# EAGLE design Torsteuerung_1.0 (EAGLE 6.4)
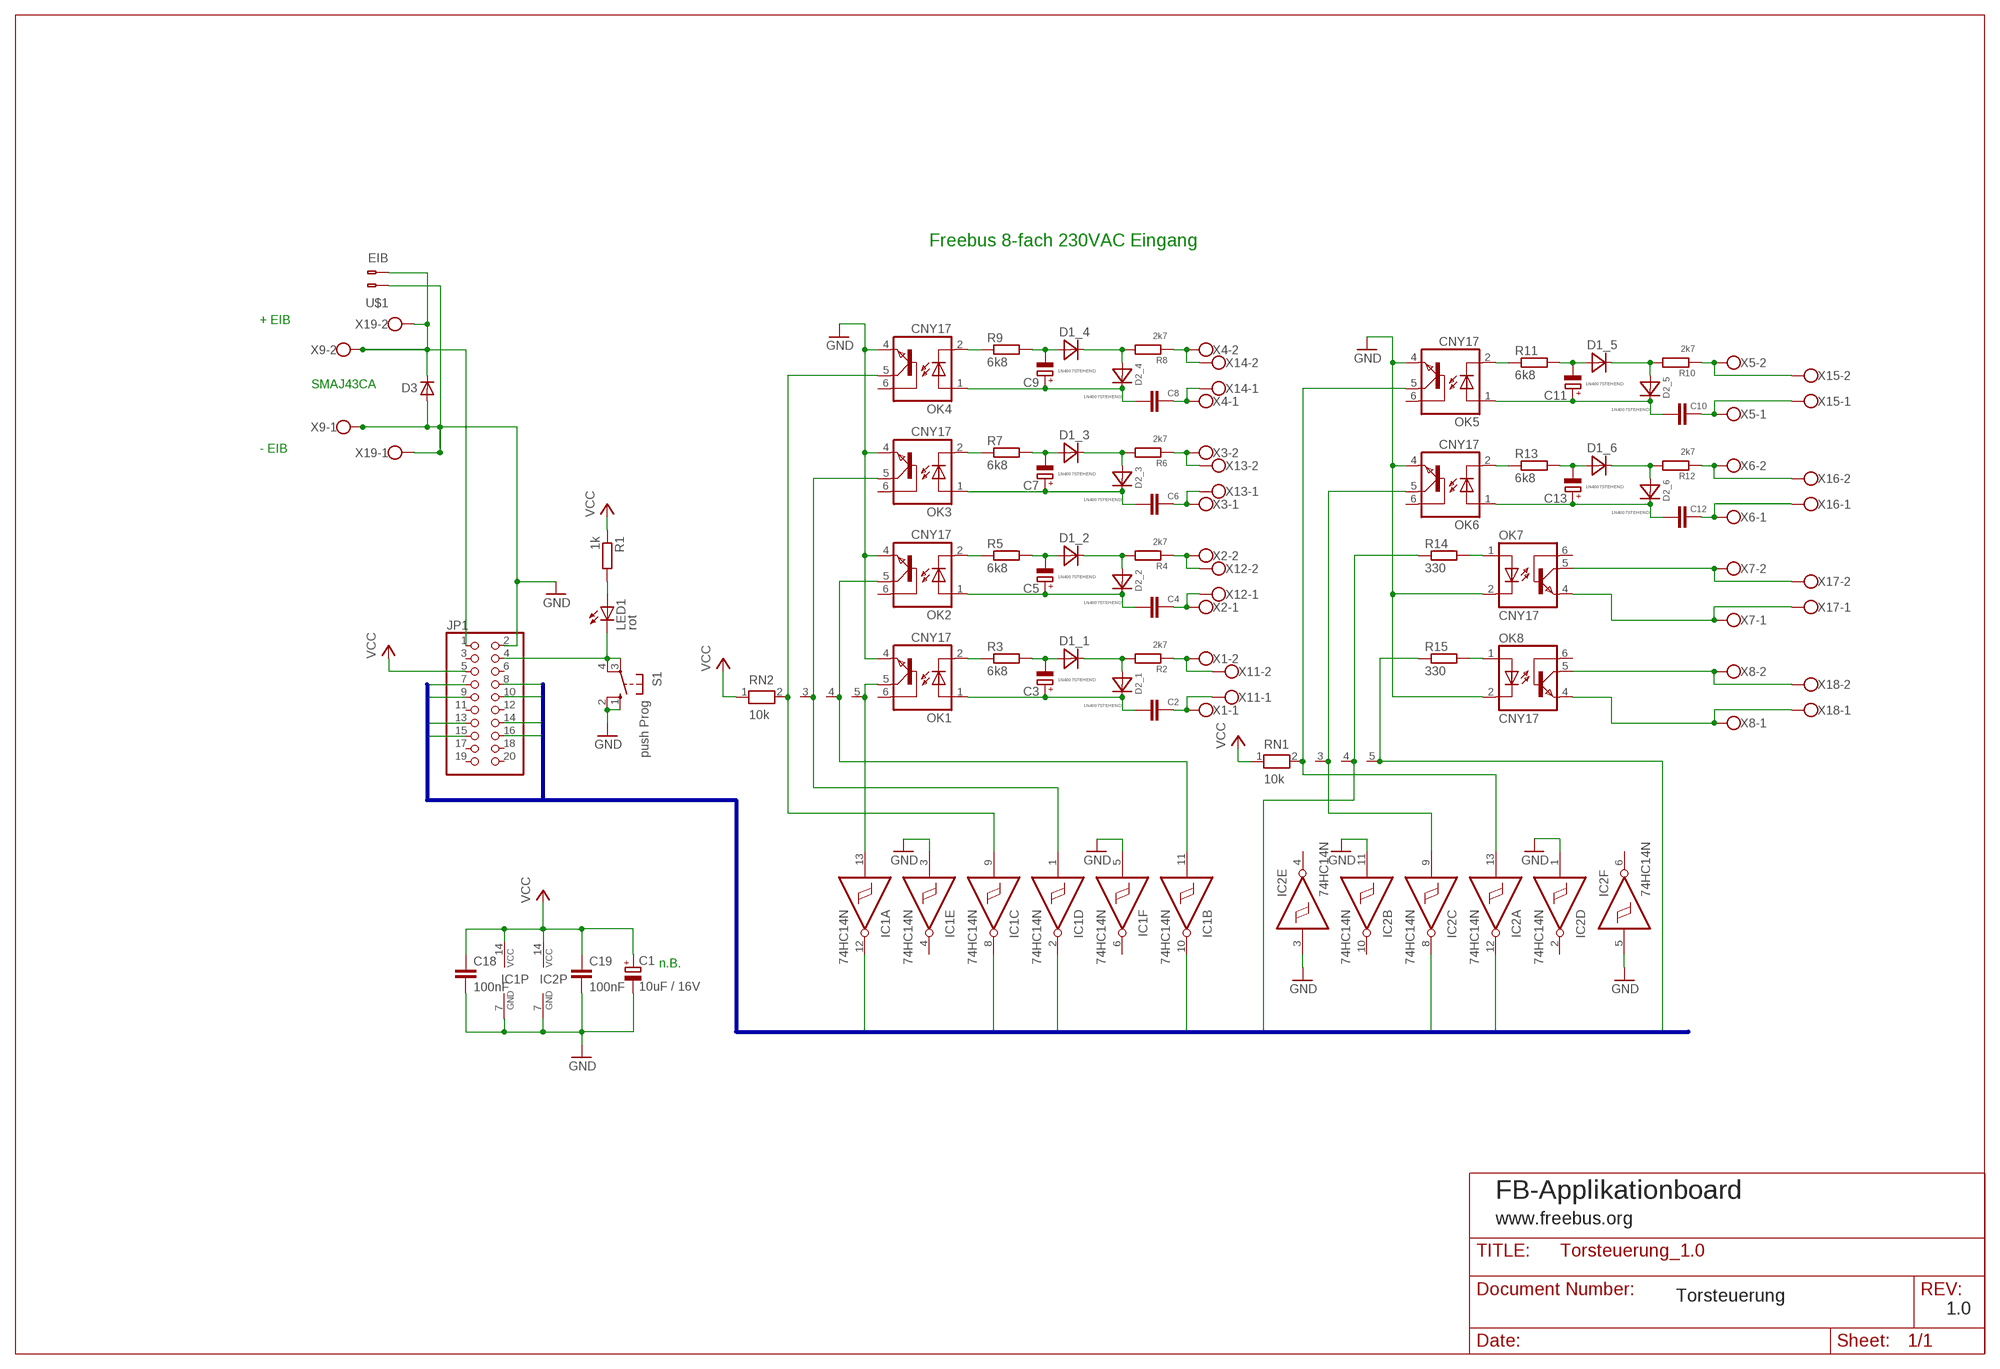
[diagram p0: schematic, sheet 1]

## Parts
C1  10uF / 16V  CPOL-EUE2-4  [E2-4]
C2  C-EU075-063X106  [C075-063X106]
C3  CPOL-EUE2-4  [E2-4]
C4  C-EU075-063X106  [C075-063X106]
C5  CPOL-EUE2-4  [E2-4]
C6  C-EU075-063X106  [C075-063X106]
C7  CPOL-EUE2-4  [E2-4]
C8  C-EU075-063X106  [C075-063X106]
C9  CPOL-EUE2-4  [E2-4]
C10  C-EU075-063X106  [C075-063X106]
C11  CPOL-EUE2-4  [E2-4]
C12  C-EU075-063X106  [C075-063X106]
C13  CPOL-EUE2-4  [E2-4]
C18  100nF  C-EU050-024X044  [C050-024X044]
C19  100nF  C-EU050-024X044  [C050-024X044]
D1_1  1N4007STEHEND  [RAD2,5]
D1_2  1N4007STEHEND  [RAD2,5]
D1_3  1N4007STEHEND  [RAD2,5]
D1_4  1N4007STEHEND  [RAD2,5]
D1_5  1N4007STEHEND  [RAD2,5]
D1_6  1N4007STEHEND  [RAD2,5]
D2_1  1N4007STEHEND  [RAD2,5]
D2_2  1N4007STEHEND  [RAD2,5]
D2_3  1N4007STEHEND  [RAD2,5]
D2_4  1N4007STEHEND  [RAD2,5]
D2_5  1N4007STEHEND  [RAD2,5]
D2_6  1N4007STEHEND  [RAD2,5]
D3  D-SMB  [SMB]
IC1  74HC14N  [DIL14]
IC2  74HC14N  [DIL14]
JP1  PINHD-2X10  [2X10]
LED1  rot  LED3MM  [LED3MM]
OK1  CNY17  [DIL06]
OK2  CNY17  [DIL06]
OK3  CNY17  [DIL06]
OK4  CNY17  [DIL06]
OK5  CNY17  [DIL06]
OK6  CNY17  [DIL06]
OK7  CNY17  [DIL06]
OK8  CNY17  [DIL06]
R1  1k  R-EU_0204/7  [0204/7]
R2  2k7  R-EU_0207/2V  [0207/2V]
R3  6k8  R-EU_0207/2V  [0207/2V]
R4  2k7  R-EU_0207/2V  [0207/2V]
R5  6k8  R-EU_0207/2V  [0207/2V]
R6  2k7  R-EU_0207/2V  [0207/2V]
R7  6k8  R-EU_0207/2V  [0207/2V]
R8  2k7  R-EU_0207/2V  [0207/2V]
R9  6k8  R-EU_0207/2V  [0207/2V]
R10  2k7  R-EU_0207/2V  [0207/2V]
R11  6k8  R-EU_0207/2V  [0207/2V]
R12  2k7  R-EU_0207/2V  [0207/2V]
R13  6k8  R-EU_0207/2V  [0207/2V]
R14  330  R-EU_0204/5  [0204/5]
R15  330  R-EU_0204/5  [0204/5]
RN1  10k  RN04  [RN-5]
RN2  10k  RN04  [RN-5]
S1  push Prog  10-XX  [B3F-10XX]
U$1  EIB  [BUSKLEMME243-724]
X1  W237-102  [W237-102]
X2  W237-102  [W237-102]
X3  W237-102  [W237-102]
X4  W237-102  [W237-102]
X5  W237-102  [W237-102]
X6  W237-102  [W237-102]
X7  W237-102  [W237-102]
X8  W237-102  [W237-102]
X9  W237-102  [W237-102]
X11  W237-102AKL007-2P  [AKL007-02]
X12  W237-102AKL007-2P  [AKL007-02]
X13  W237-102AKL007-2P  [AKL007-02]
X14  W237-102AKL007-2P  [AKL007-02]
X15  W237-102AKL007-2P  [AKL007-02]
X16  W237-102AKL007-2P  [AKL007-02]
X17  W237-102AKL007-2P  [AKL007-02]
X18  W237-102AKL007-2P  [AKL007-02]
X19  W237-102AKL007-2P  [AKL007-02]

## Nets
230+_1: C2.1 C3.+ D2_1.C OK1.1(A)
230+_2: C4.1 C5.+ D2_2.C OK2.1(A)
230+_3: C6.1 C7.+ D2_3.C OK3.1(A)
230+_4: C8.1 C9.+ D2_4.C OK4.1(A)
230+_5: C10.1 C11.+ D2_5.C OK5.1(A)
230+_6: C12.1 C13.+ D2_6.C OK6.1(A)
230-_1: C3.- D1_1.A R3.2
230-_2: C5.- D1_2.A R5.2
230-_3: C7.- D1_3.A R7.2
230-_4: C9.- D1_4.A R9.2
230-_5: C11.- D1_5.A R11.2
230-_6: C13.- D1_6.A R13.2
230N_1: D1_1.C D2_1.A R2.2
230N_2: D1_2.C D2_2.A R4.2
230N_3: D1_3.C D2_3.A R6.2
230N_4: D1_4.C D2_4.A R8.2
230N_5: D1_5.C D2_5.A R10.2
230N_6: D1_6.C D2_6.A R12.2
GND: C1.- C18.2 C19.2 D3.2(A) IC1.3(E:I) IC1.5(F:I) IC1.7(P:GND) IC2.1(D:I) IC2.3(E:I) IC2.5(F:I) IC2.7(P:GND) IC2.11(B:I) JP1.2 OK1.4(EMI) OK2.4(EMI) OK3.4(EMI) OK4.4(EMI) OK5.4(EMI) OK6.4(EMI) OK7.2(C) OK8.2(C) S1.1(S) S1.2(S1) U$1.1(B-1) X9.1 X19.1
IO1: IC1.12(A:O) JP1.7
IO2: IC1.10(B:O) JP1.8
IO3: IC1.2(D:O) JP1.9
IO4: IC1.8(C:O) JP1.10
IO5: IC2.12(A:O) JP1.13
IO6: IC2.8(C:O) JP1.14
IO7: JP1.15 R14.1 RN1.4
IO8: JP1.16 R15.1 RN1.5
N$1: C8.2 X4.1 X14.1
N$2: R8.1 X4.2 X14.2
N$3: C6.2 X3.1 X13.1
N$4: R6.1 X3.2 X13.2
N$5: C4.2 X2.1 X12.1
N$6: R4.1 X2.2 X12.2
N$7: C2.2 X1.1 X11.1
N$8: R2.1 X1.2 X11.2
N$9: R12.1 X6.2 X16.2
N$10: C12.2 X6.1 X16.1
N$11: OK7.5(COL) X7.2 X17.2
N$12: OK8.4(EMI) X8.1 X18.1
N$13: R10.1 X5.2 X15.2
N$14: C10.2 X5.1 X15.1
N$15: OK7.4(EMI) X7.1 X17.1
N$16: OK8.5(COL) X8.2 X18.2
N$18: IC2.13(A:I) OK5.5(COL) RN1.2
N$19: IC2.9(C:I) OK6.5(COL) RN1.3
N$20: D3.1(C) JP1.1 U$1.2(B-2) X9.2 X19.2
N$21: OK8.1(A) R15.2
N$22: OK7.1(A) R14.2
N$23: IC1.13(A:I) OK1.5(COL) RN2.5
N$25: IC1.11(B:I) OK2.5(COL) RN2.4
N$27: JP1.4 LED1.K(C) S1.3(P) S1.4(P1)
N$28: LED1.A R1.2
N$29: IC1.1(D:I) OK3.5(COL) RN2.3
N$30: IC1.9(C:I) OK4.5(COL) RN2.2
OPT_1: OK1.2(C) R3.1
OPT_2: OK2.2(C) R5.1
OPT_3: OK3.2(C) R7.1
OPT_4: OK4.2(C) R9.1
OPT_5: OK5.2(C) R11.1
OPT_6: OK6.2(C) R13.1
VCC: C1.+ C18.1 C19.1 IC1.14(P:VCC) IC2.14(P:VCC) JP1.5 R1.1 RN1.1 RN2.1
Unconnected: IC1.4(E:O) IC1.6(F:O) IC2.2(D:O) IC2.4(E:O) IC2.6(F:O) IC2.10(B:O) JP1.3 JP1.6 JP1.11 JP1.12 JP1.17 JP1.18 JP1.19 JP1.20 OK1.6(BAS) OK2.6(BAS) OK3.6(BAS) OK4.6(BAS) OK5.6(BAS) OK6.6(BAS) OK7.6(BAS) OK8.6(BAS)

## Buses
IO[1..8]

## Notes on the sheet
- Freebus 8-fach 230VAC Eingang
- + EIB
- SMAJ43CA
- - EIB
- n.B.
- FB-Applikationboard
- www.freebus.org
- Torsteuerung
- 1.0

## Library data of the parts
C1 C3 C5 C7 C9 C11 C13 = rcl:CPOL-EU: POLARIZED CAPACITOR, European symbol
C2 C4 C6 C8 C10 C12 C18 C19 = rcl:C-EU: CAPACITOR, European symbol
D1_1-D1_6 D2_1-D2_6 = diode:1N4007
D3 = semicon-smd-ipc:D-: DIODE unfilled
IC1 IC2 = 74xx-eu:74*14: Hex schmitt trigger INVERTER
JP1 = pinhead:PINHD-2X10: PIN HEADER
LED1 = led:LED: LED OSRAM: - CHIPLED LG R971, LG N971, LY N971, LG Q971, LY Q971, LO R971, LY R971 LH N974, LH R974 LS Q976, LO Q976, LY Q976 LO Q996 - Hyper CHIPLED LW Q18S LB Q993, LB Q99A, LB R99A - SideLED LS A670, LO A670, LY A670, LG A670, LP A670 LB A673, LV A673, LT A673, LW A673 LH A674 LY A675 LS A676, LA A676, LO A676, LY A676, LW A676 LS A679, LY A679, LG A679 - Hyper Micro SIDELED® LS Y876, LA Y876, LO Y876, LY Y876 LT Y87S - SmartLED LW L88C, LW L88S LB L89C, LB L89S, LG L890 LS L89K, LO L89K, LY L89K LS L896, LA L896, LO L896, LY L896 - TOPLED LS T670, LO T670, LY T670, LG T670, LP T670 LSG T670, LSP T670, LSY T670, LOP T670, LYG T670 LG T671, LOG T671, LSG T671 LB T673, LV T673, LT T673, LW T673 LH T674 LS T676, LA T676, LO T676, LY T676, LB T676, LH T676, LSB T676, LW T676 LB T67C, LV T67C, LT T67C, LS T67K, LO T67K, LY T67K, LW E67C LS E67B, LA E67B, LO E67B, LY E67B, LB E67C, LV E67C, LT E67C LW T67C LS T679, LY T679, LG T679 LS T770, LO T770, LY T770, LG T770, LP T770 LB T773, LV T773, LT T773, LW T773 LH T774 LS E675, LA E675, LY E675, LS T675 LS T776, LA T776, LO T776, LY T776, LB T776 LHGB T686 LT T68C, LB T68C - Hyper Mini TOPLED® LB M676 - Mini TOPLED Santana® LG M470 LS M47K, LO M47K, LY M47K Source: http://www.osram.convergy.de - LUMILED® LXK2-PW12-R00, LXK2-PW12-S00, LXK2-PW14-U00, LXK2-PW14-V00 LXK2-PM12-R00, LXK2-PM12-S00, LXK2-PM14-U00 LXK2-PE12-Q00, LXK2-PE12-R00, LXK2-PE12-S00, LXK2-PE14-T00, LXK2-PE14-U00 LXK2-PB12-K00, LXK2-PB12-L00, LXK2-PB12-M00, LXK2-PB14-N00, LXK2-PB14-P00, LXK2-PB14-Q00 LXK2-PR12-L00, LXK2-PR12-M00, LXK2-PR14-Q00, LXK2-PR14-R00 LXK2-PD12-Q00, LXK2-PD12-R00, LXK2-PD12-S00 LXK2-PH12-R00, LXK2-PH12-S00 LXK2-PL12-P00, LXK2-PL12-Q00, LXK2-PL12-R00 Source: www.luxeon.com
OK1-OK8 = optocoupler:CNY17: SIEMENS OPTO COUPLER
R1-R15 = rcl:R-EU_: RESISTOR, European symbol
RN1 RN2 = resistor-net:RN04: RESISTOR NETWORK
S1 = switch-omron:10-XX: OMRON SWITCH
U$1 = con-wago:EIB
X1-X9 X11-X19 = con-wago-500:W237-102: WAGO SCREW CLAMP

## Board
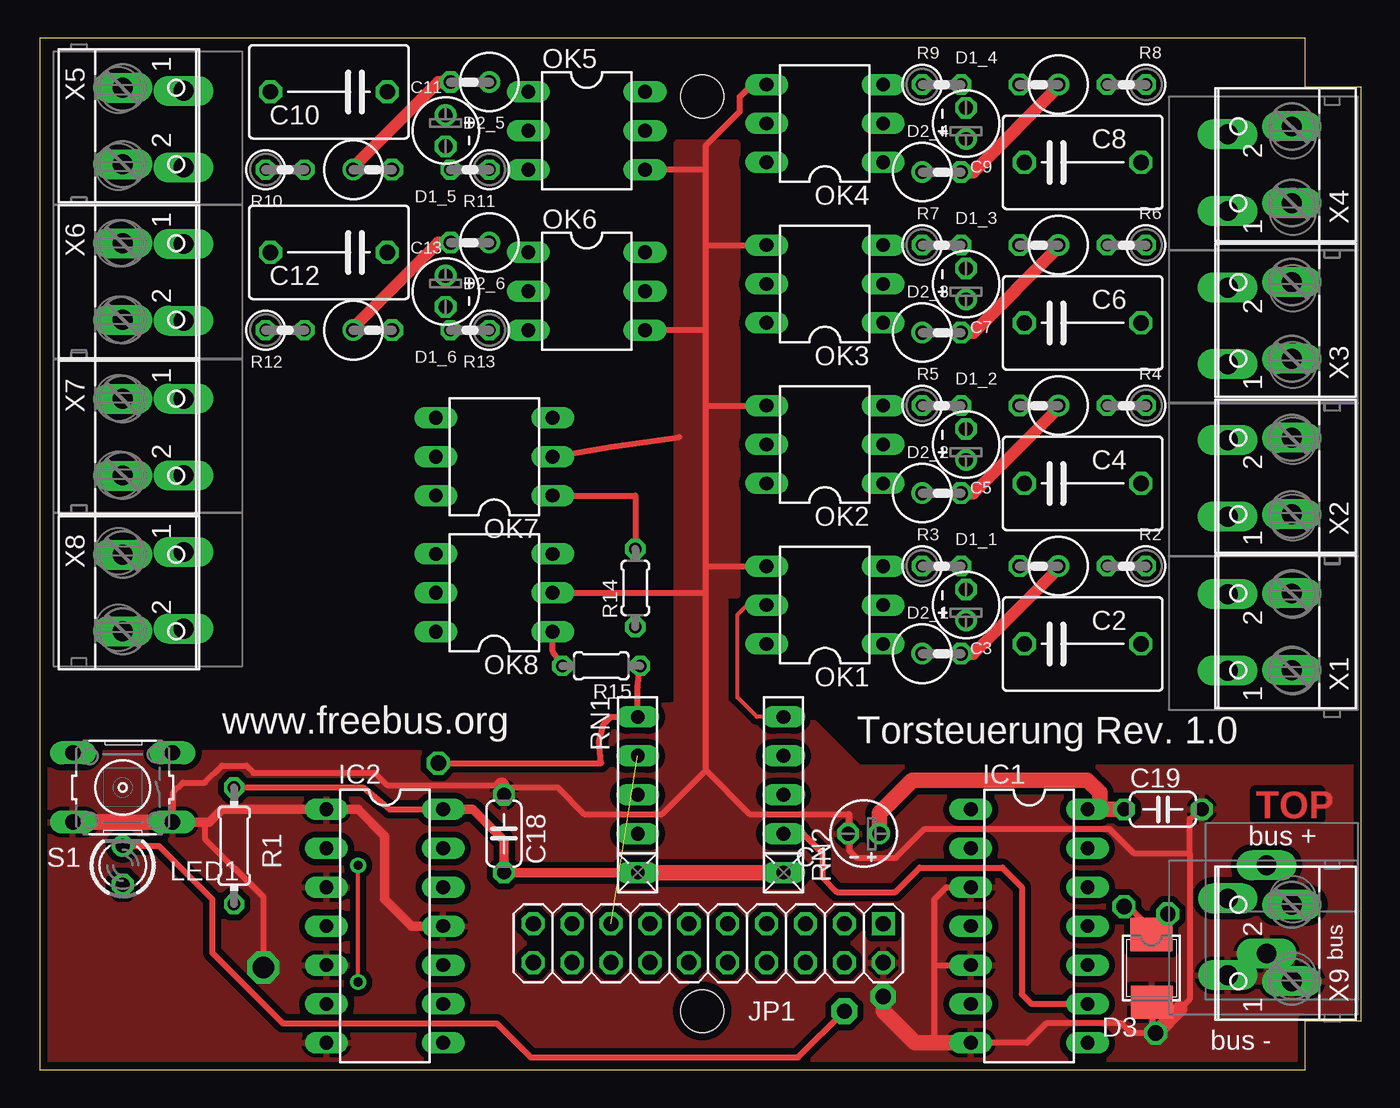
[diagram p1: board, top side]
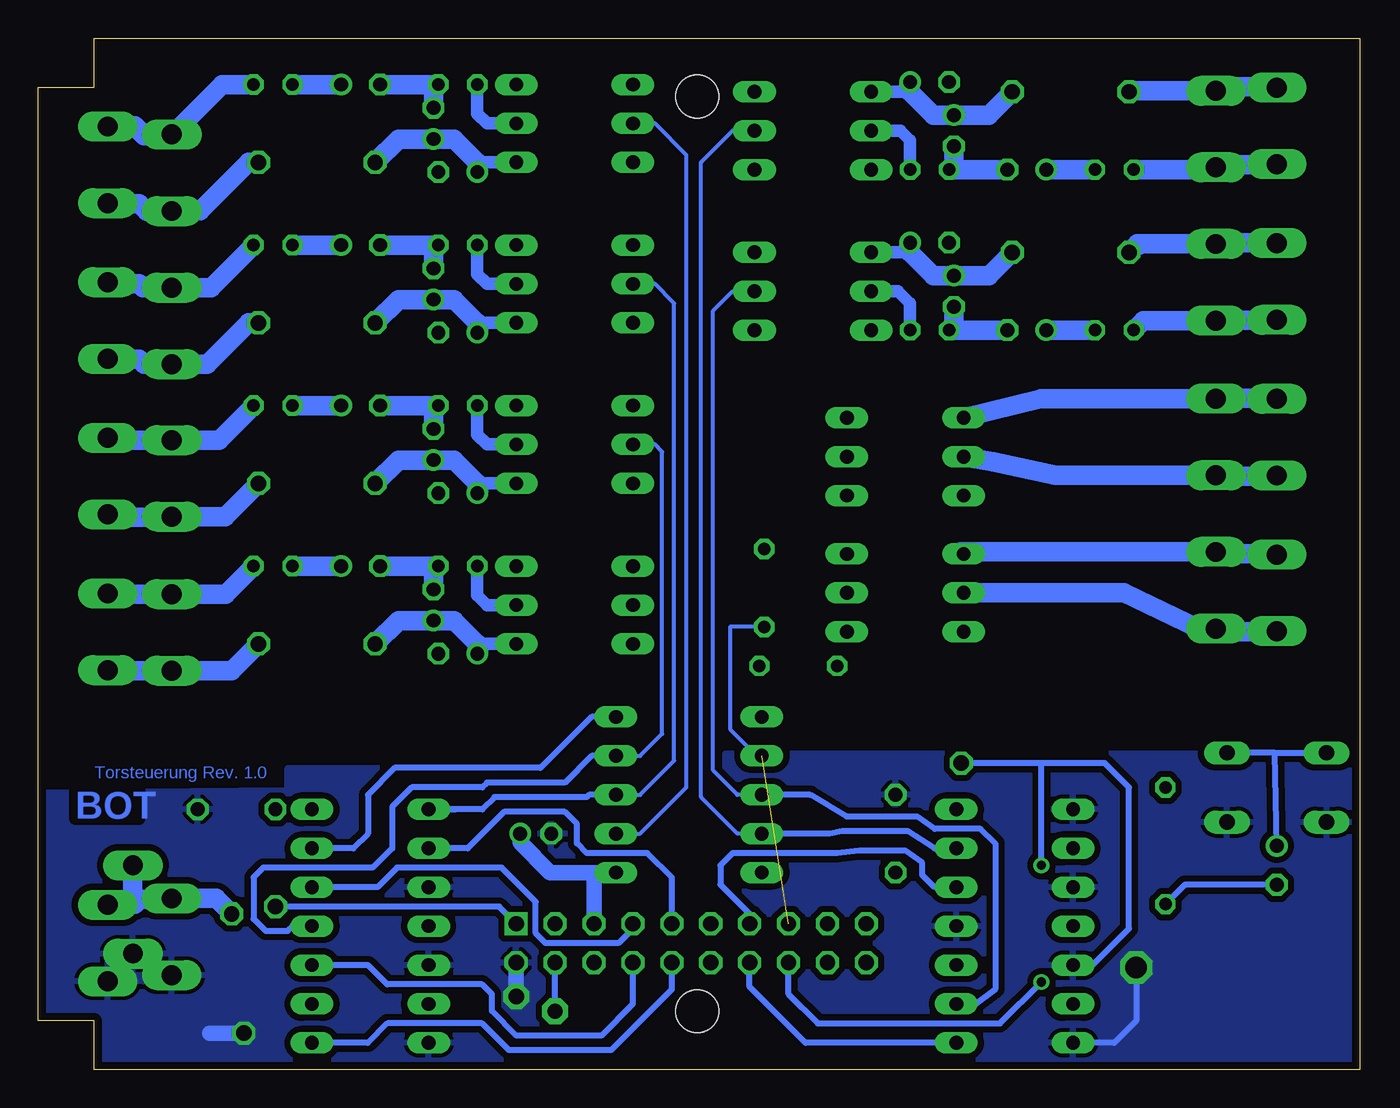
[diagram p2: board, bottom side, seen from below]

Size 86.28 x 67.31 mm. Coordinates in mm from the lower left corner, seen from the top.
Outline: 0,0.01 82.64,0 82.64,3.18 86.28,3.18 86.28,64.13 82.64,64.13 82.64,67.31 0,67.31 0,0.01
Copper layers (1*16): Top 0.035mm / dielectric 1.5mm / Bottom 0.035mm
Design rules "default": minimum track width 10mil, minimum drill 24mil, track to track 16mil, track to pad 12mil, pad to pad 16mil, via to via 16mil, smd to smd 8mil, copper to edge 20mil, drill to drill 10mil, minimum pad ring 10mil, minimum via ring 8mil, stop-mask expansion 4mil, vias tented up to drill 0mil, thermal gap 10mil
Holes 2.8 mm at 43.27,3.81 43.27,63.5

### Footprints (pad centres in the part's own frame; a part is rotated, then mirrored left to right if it is on the bottom)
E2-4 = drill 0.9 pad 1.27: + -1.016,0 | drill 0.9 pad 1.27 octagon: - 1.016,0
C075-063X106 = drill 1 octagon: 1 -3.81,0; 2 3.81,0
C050-024X044 = drill 0.9 octagon: 1 -2.54,0; 2 2.54,0
RAD2,5 = drill 0.9 octagon: A 1.27,0 | drill 0.9: C -1.27,0
SMB = smd 2.159 x 2.743: 1 -2.311,-0.127; 2 2.108,-0.102
DIL14 = drill 0.9 long: 1 -7.62,-3.81; 2 -5.08,-3.81; 3 -2.54,-3.81; 4 0,-3.81; 5 2.54,-3.81; 6 5.08,-3.81; 7 7.62,-3.81; 8 7.62,3.81; 9 5.08,3.81; 10 2.54,3.81; 11 0,3.81; 12 -2.54,3.81; 13 -5.08,3.81; 14 -7.62,3.81
2X10 = drill 1 square: 1 -11.43,-1.27 | drill 1 octagon: 2 -11.43,1.27; 3 -8.89,-1.27; 4 -8.89,1.27; 5 -6.35,-1.27; 6 -6.35,1.27; 7 -3.81,-1.27; 8 -3.81,1.27; 9 -1.27,-1.27; 10 -1.27,1.27; 11 1.27,-1.27; 12 1.27,1.27; 13 3.81,-1.27; 14 3.81,1.27; 15 6.35,-1.27; 16 6.35,1.27; 17 8.89,-1.27; 18 8.89,1.27; 19 11.43,-1.27; 20 11.43,1.27
LED3MM = drill 0.9 octagon: A -1.27,0 | drill 0.9: K 1.27,0
DIL06 = drill 0.9 long: 1 -2.54,-3.81; 2 0,-3.81; 3 2.54,-3.81; 4 2.54,3.81; 5 0,3.81; 6 -2.54,3.81
0204/7 = drill 0.813 octagon: 1 -3.81,0; 2 3.81,0
0207/2V = drill 0.813 octagon: 1 -1.27,0; 2 1.27,0
0204/5 = drill 0.813 octagon: 1 -2.54,0; 2 2.54,0
RN-5 = drill 0.9 long: 1 -5.08,0; 2 -2.54,0; 3 0,0; 4 2.54,0; 5 5.08,0
B3F-10XX = drill 1 long: 1 -3.251,2.261; 2 3.251,2.261; 3 -3.251,-2.261; 4 3.251,-2.261
BUSKLEMME243-724 = drill 1.3 long: 1 -2.875,0; 2 2.875,0
W237-102 = drill 1.3 long: 1 -2.5,-1.27; 2 2.5,-1.27
AKL007-02 = drill 1.3 long: 1 -2.45,2.325; 2 2.55,2.325

### Placement (x,y rotation side)
C1  53.81,15.4 180 top
C2  68.1,27.78 0 top
C3  60.48,30.32 90 top
C4  68.1,38.26 0 top
C5  60.48,40.8 90 top
C6  68.1,48.74 0 top
C7  60.48,51.28 90 top
C8  68.1,59.21 0 top
C9  60.48,61.75 90 top
C10  18.88,63.82 180 top
C11  26.5,61.28 270 top
C12  18.88,53.34 180 top
C13  26.5,50.8 270 top
C18  30.31,15.4 90 top
C19  73.34,16.99 0 top
D1_1  65.24,32.86 180 top
D1_2  65.24,43.34 180 top
D1_3  65.24,53.82 180 top
D1_4  65.24,64.29 180 top
D1_5  21.74,58.74 0 top
D1_6  21.74,48.26 0 top
D2_1  58.89,27.15 0 top
D2_2  58.89,37.62 0 top
D2_3  58.89,48.1 0 top
D2_4  58.89,58.58 0 top
D2_5  28.09,64.45 180 top
D2_6  28.09,53.98 180 top
D3  72.7,6.51 270 top
IC1  64.61,9.37 270 top
IC2  22.54,9.37 270 top
JP1  43.65,8.26 180 top
LED1  5.42,13.33 90 top
OK1  51.27,30.32 90 top
OK2  51.27,40.8 90 top
OK3  51.27,51.28 90 top
OK4  51.27,61.75 90 top
OK5  35.71,61.28 270 top
OK6  35.71,50.8 270 top
OK7  29.68,40 90 top
OK8  29.68,31.12 90 top
R1  12.69,14.6 270 top
R2  70.95,32.86 180 top
R3  58.89,32.86 0 top
R4  70.95,43.34 180 top
R5  58.89,43.34 0 top
R6  70.95,53.82 180 top
R7  58.89,53.82 0 top
R8  70.95,64.29 180 top
R9  58.89,64.29 0 top
R10  16.03,58.74 0 top
R11  28.09,58.74 180 top
R12  16.03,48.26 0 top
R13  28.09,48.26 180 top
R14  38.89,31.43 90 top
R15  36.66,26.35 180 top
RN1  39.05,17.94 90 top
RN2  48.57,17.94 90 top
S1  5.42,18.42 180 top
U$1  80.11,10.45 90 top
X1  80.48,28.58 90 top
X2  80.48,38.73 90 top
X3  80.48,48.89 90 top
X4  80.48,59.05 90 top
X5  6.69,61.59 270 top
X6  6.69,51.43 270 top
X7  6.69,41.27 270 top
X8  6.69,31.12 270 top
X9  80.48,8.26 90 top
X11  79.89,28.49 90 top
X12  79.89,38.53 90 top
X13  79.89,48.49 90 top
X14  79.89,58.49 90 top
X15  7.07,61.43 270 top
X16  7.07,51.43 270 top
X17  7.07,41.34 270 top
X18  7.07,31.34 270 top
X19  79.9,8.62 90 top

### Tracks (layer width: path | path; a pad name or v marks a point on that pad's centre or on a via)
230+_1
  Bottom 0.813: OK1.1 56.98,27.78 D2_1.C
  Bottom 1.27: C2.1 62.76,29.31 C3.+ 59.14,29.31 57.62,27.78 D2_1.C
230+_2
  Bottom 0.813: OK2.1 56.98,38.26 D2_2.C
  Bottom 1.27: C4.1 62.76,39.78 C5.+ 59.14,39.78 57.62,38.26 D2_2.C
230+_3
  Bottom 0.813: OK3.1 56.98,48.74 D2_3.C
  Bottom 1.27: C6.1 62.76,50.26 C7.+ 59.14,50.26 57.62,48.74 D2_3.C
230+_4
  Bottom 0.813: D2_4.C 57.62,58.74 57.14,59.21 OK4.1
  Bottom 1.27: C8.1 62.76,60.74 C9.+ 59.14,60.74 57.62,59.21 D2_4.C
230+_5
  Bottom 0.813: OK5.1 30,63.82 D2_5.C
  Bottom 1.27: C10.1 24.22,62.29 C11.+ 27.84,62.29 29.36,63.82 D2_5.C
230+_6
  Bottom 0.813: OK6.1 30,53.34 D2_6.C
  Bottom 1.27: C12.1 24.22,51.82 C13.+ 27.84,51.82 29.36,53.34 D2_6.C
230-_1
  Bottom 1.27: 60.48,32.86 D1_1.A | 60.48,32.86 R3.2 | C3.- 60.48,32.86
230-_2
  Bottom 1.27: 60.48,43.34 D1_2.A | 60.48,43.34 R5.2 | C5.- 60.48,43.34
230-_3
  Bottom 1.27: 60.48,53.82 D1_3.A | 60.48,53.82 R7.2 | C7.- 60.48,53.82
230-_4
  Bottom 1.27: 60.48,64.29 D1_4.A | 60.48,64.29 R9.2 | C9.- 60.48,64.29
230-_5
  Bottom 1.27: D1_5.A 26.5,58.74 | 26.5,58.74 R11.2 | 26.5,58.74 C11.-
230-_6
  Bottom 1.27: D1_6.A 26.35,48.26 | 26.35,48.26 R13.2 | C13.- 26.5,48.42 26.35,48.26
230N_1
  Top 0.813: D2_1.A 60.95,27.15 66.51,32.7 D1_1.C
  Bottom 1.27: D1_1.C R2.2
230N_2
  Top 0.813: D2_2.A 60.95,37.62 66.51,43.18 D1_2.C
  Bottom 1.27: D1_2.C R4.2
230N_3
  Top 0.813: D2_3.A 60.95,48.1 66.51,53.66 D1_3.C
  Bottom 1.27: D1_3.C R6.2
230N_4
  Top 0.813: D2_4.A 60.95,58.58 66.51,64.14 D1_4.C
  Bottom 1.27: D1_4.C R8.2
230N_5
  Top 0.813: D2_5.A 26.03,64.45 20.47,58.9 D1_5.C
  Bottom 1.27: R10.2 D1_5.C
230N_6
  Top 0.813: D2_6.A 26.03,53.98 20.47,48.42 D1_6.C
  Bottom 0.813: D1_6.C 20.47,48.1 20.31,48.26
  Bottom 1.27: R12.2 20.31,48.26
GND  (via drill 1 pad 1.42, 1 pad 1.68, 1.4)
  Top 0.406: 43.49,32.86 OK1.4 | 43.49,43.34 OK2.4 | 43.49,32.86 43.49,43.34 | 43.49,48.26 OK6.4 | 43.49,43.34 43.49,48.26 | 43.49,53.82 OK3.4 | 43.49,48.26 43.49,53.82 | 43.49,58.74 OK5.4 | 43.49,53.82 43.49,58.74 | OK4.4 46.51,64.29 45.71,63.5 45.71,62.55 43.49,60.32 43.49,58.74 | 52.79,16.67 C1.- | 43.49,19.53 43.49,31.12 | 43.49,31.12 43.49,32.86 | 43.49,19.53 46.35,16.67 52.79,16.67 | 43.49,19.53 40.63,16.67 35.55,16.67 33.81,18.42 30.31,18.42 | 74.45,3.97 75.08,4.6 75.08,14.13 | C18.2 30.31,18.42 | 30.31,18.42 | 10.79,16.15 10.79,15.08 14.6,11.27 v14.6,6.67 | D3.2 72.72,2.53 v72.86,2.38 71.27,2.38 70.64,3.02 65.72,3.02 64.45,1.75 IC1.7 | IC1.3 59.21,11.91 58.41,11.11 58.41,6.83 | 58.25,1.75 58.25,1.91 58.41,2.06 58.41,6.83 | 58.41,6.83 IC1.5 | C19.2 75.72,16.99 75.08,16.35 75.08,14.13 | 30.16,18.57 22.7,18.57 21.9,19.37 13.96,19.37 13.49,19.84 11.9,19.84 10.79,18.73 9.36,18.73 8.73,18.1 8.73,16.19 8.76,16.15 S1.1 | v14.6,6.67 | 52.79,16.67 52.86,16.67 52.86,14.29 53.33,13.81 55.87,13.81 57.78,15.72 69.84,15.72 71.43,14.13 75.08,14.13 | OK7.2 37.3,40.64 41.74,41.27 | OK8.2 43.49,31.12 | IC2.11
  Top 0.61: S1.1 10.79,16.15 11.07,16.15 11.9,16.99 IC2.1 | IC2.1 | IC2.1 | IC2.11 24.28,9.37 22.54,11.11 22.54,15.24 20.79,16.99 18.88,16.99 | 18.88,16.99 | IC2.1 18.88,16.99
  Top 1.016: v55.08,4.76 55.08,3.81 57.14,1.75 58.25,1.75 IC1.7 61.27,1.75 | 74.45,3.97 v72.86,2.38 | 5.55,16.19 2.38,16.19 2.38,16.15 S1.2 2.22,16.15 2.22,16.19 2.25,16.15 S1.1 | 30.16,18.57 | 30.16,18.57 C18.2
  Bottom 0.406: S1.1 8.8,16.19 | v14.6,6.67 14.6,3.17 16.03,1.75 IC2.7 | IC2.7
  Bottom 1.016: v55.08,4.76 | v55.08,4.76 JP1.2 | v72.86,2.38 75.08,2.38
  pour Top: 41.59,23.18 44.76,23.18 44.76,30.96 45.55,30.96 45.55,60.48 41.59,60.48
  pour Top: 11.42,0.32 82.26,0.44 82.27,3.56 86.08,3.56 85.88,19.68 53.49,19.69 49.21,23.97 35.87,23.65 35.55,20.64 0.31,20.64 0.31,10.64 0.31,0.16
  pour Bottom: 0.31,20.64 0.31,0.32 82.23,0.48 82.23,3.49 85.88,3.65 85.88,18.1 70,18.26 70,19.69 41.43,19.68 41.43,20.64
IO1
  Bottom 0.406: JP1.7 47.46,9.21 48.41,8.26 53.17,8.26 53.81,8.89 53.81,10.95 56.03,13.18 62.86,13.18 64.13,11.91 IC1.12
IO2
  Bottom 0.406: IC1.10 64.76,6.83 63.49,5.56 57.3,5.56 56.67,4.92 56.67,3.81 55.08,2.22 49.52,2.22 | 49.52,2.22 | JP1.8 47.46,4.29 49.52,2.22
IO3
  Bottom 0.406: JP1.9 44.92,12.54 46.51,14.13 50.48,14.13 51.11,14.76 51.11,16.03 51.91,16.83 55.87,16.83 58.25,14.45 IC1.2
IO4
  Bottom 0.406: IC1.8 64.76,1.75 63.49,3.02 57.3,3.02 55.56,1.27 48.89,1.27 44.92,5.24 JP1.10
IO5
  Bottom 0.406: IC2.12 27.77,11.91 28.57,12.7 28.57,13.49 29.68,14.29 32.7,14.29 34.12,14.13 40.95,14.13 41.74,13.33 41.74,12.06 39.84,10.16 JP1.13
IO6
  Bottom 0.406: IC2.8 36.19,1.75 39.84,5.4 JP1.14
IO7  (1 unrouted)
  Bottom 0.254: R14.1 41.11,28.89 41.11,22.23 39.84,20.96 RN1.4
IO8  (via drill 0.61, 1)
  Top 0.254: v20.79,5.71 v20.79,13.33
  Top 0.406: v26.03,20 36.66,20 36.51,21.43 36.82,22.54 37.3,23.02 RN1.5 39.05,24.92 R15.1
  Bottom 0.406: JP1.16 37.3,4.92 35.39,3.02 23.49,3.02 v20.79,5.71 | 17.46,6.83 15.08,9.21 15.08,18.42 16.66,20 20.79,20 | v20.79,13.33 20.79,20 | 20.79,20 v26.03,20
N$1
  Bottom 1.27: C8.2 72.54,59.21 75.72,56.04 77.46,56.04 X14.1 79.21,56.04 79.69,56.52 81.75,56.52 X4.1
N$2
  Bottom 1.27: 77.62,60.96 77.56,60.96 X14.2 | R8.1 74.29,64.29 77.62,60.96 | 77.62,60.96 79.37,60.96 80,61.59 81.71,61.59 X4.2
N$3
  Bottom 1.27: C6.2 72.54,48.74 75.24,46.04 X13.1 79.37,46.04 79.69,46.35 81.75,46.35 X3.1
N$4
  Bottom 1.27: R6.1 75,51.04 X13.2 79.45,51.04 79.69,51.28 81.75,51.28 X3.2
N$5
  Bottom 1.27: C4.2 74.08,36.09 X12.1 | 77.62,36.04 77.62,36.09 X12.1 | X12.1 77.57,36.09 77.62,36.04 | X2.1 81.75,36.2 81.59,36.04 77.62,36.04
N$6
  Bottom 1.27: R4.1 74.48,41.09 X12.2 81.72,41.09 81.75,41.12 X2.2
N$7
  Bottom 1.27: C2.2 73.65,26.04 X11.1 | X11.1 77.62,26.04 X11.1 | X1.1 81.75,26.04 X11.1
  Bottom 1.676: X11.1
N$8
  Bottom 1.27: R2.1 74.05,31.04 77.39,31.04 77.46,31.12 77.46,31.04 X11.2 81.67,31.04 81.75,31.12 X1.2
N$9
  Bottom 1.27: R12.1 14.13,48.88 X16.2 9.38,48.89 5.55,48.89 X6.2
N$10
  Bottom 1.27: C12.2 14.53,53.88 14.44,53.88 14.44,53.82 14.37,53.88 X16.1 9.31,53.98 5.55,53.98 X6.1
N$11
  Bottom 1.27: 9.4,38.73 X17.2 19.89,38.78 23.96,39.69 OK7.5 | X7.2 5.55,38.73 9.35,38.73
  Bottom 1.676: 9.35,38.73 X17.2
N$12
  Bottom 1.27: X8.1 5.55,33.66 9.27,33.66 X18.1 26.06,33.78 OK8.4
N$13
  Bottom 0.813: X15.2 9.36,58.88 9.36,58.9 9.52,58.74
  Bottom 1.27: 9.52,58.74 R10.1 | X5.2 5.55,59.05 9.2,59.05 9.36,58.9
N$14
  Bottom 0.813: 15.01,63.88 C10.2
  Bottom 1.27: 15.01,63.88 X15.1 9.15,64.14 5.55,64.14 X5.1
N$15
  Bottom 1.27: X7.1 5.55,43.81 9.37,43.81 | X17.1 20.82,43.78 OK7.4
  Bottom 1.676: 9.37,43.81 X17.1
N$16
  Bottom 1.27: X8.2 5.55,28.58 9.19,28.58 X18.2 10.52,28.79 15.39,31.12 OK8.5
N$18
  Bottom 0.254: OK5.5 40.95,61.28 43.02,59.21 43.02,17.78 40.63,15.4 RN1.2
  Bottom 0.406: RN1.2 34.6,15.4 33.81,15.56 29.52,15.56 27.77,14.45 IC2.13
N$19
  Bottom 0.254: OK6.5 40.95,50.8 42.22,49.53 42.22,19.53 40.63,17.94 RN1.3
  Bottom 0.406: RN1.3 35.87,17.94 33.49,16.51 28.89,16.51 27.77,15.72 24.76,15.72 23.81,14.76 23.81,5.24 25.08,4.29 IC2.9
N$20  (via drill 1)
  Top 0.406: v70.8,10.64 71.11,10.64 72.62,9.13 | 72.62,9.13 72.7,9.05 72.7,8.1 | 72.7,8.1 | 72.7,8.1 D3.1 | 72.62,9.13 72.62,9.21 72.7,9.21 v73.65,10.16
  Bottom 0.406: JP1.1 56.19,10.64 v70.8,10.64
  Bottom 1.27: v73.65,10.16 74.66,11.17 X19.2 77.63,11.11 79.69,11.11 | U$1.2 80.11,11.53 79.69,11.11 | X9.2 81.75,10.79 80,10.79 79.69,11.11
N$21
  Top 0.406: R15.2 33.49,27.31 OK8.1
N$22
  Top 0.406: OK7.1 38.89,37.46 R14.2
N$23
  Top 0.254: OK1.5 46.19,30.32 45.55,29.69 45.55,24.29 46.82,23.02 RN2.5
  Bottom 0.406: RN2.5 50.16,23.02 | IC1.13 65.72,14.45 64.76,15.4 64.76,17.94 63.02,19.69 53.49,19.69 50.16,23.02 | 50.16,23.02
N$25
  Bottom 0.254: 48.41,20.48 46.98,20.48 45.55,21.91 45.55,40.32 46.03,40.8 OK2.5
  Bottom 0.406: 48.41,20.48 RN2.4 50.16,20.48 51.91,18.73 56.98,18.73 57.3,18.42 61.91,18.42 63.18,17.15 63.18,14.45 64.45,13.18 71.59,13.18 72.22,12.54 72.22,9.84 71.43,9.05 70,9.05 69.69,9.37 IC1.11
N$27  (via drill 1 pad 1.68)
  Top 0.406: v52.54,3.81 49.52,0.79 32.06,0.79 29.84,3.02 15.87,3.02 11.27,7.62 11.27,11.11 7.77,14.61 5.71,14.61 5.55,14.45 LED1.K
  Bottom 0.406: S1.3 8.73,20.68 8.73,20.64 8.69,20.68 5.55,20.68 | 5.55,20.68 S1.4 | v52.54,3.81 JP1.4 | LED1.K 5.55,20.68
N$28
  Bottom 0.406: R1.2 | LED1.A 11.42,12.06 R1.2
N$29
  Bottom 0.254: 46.03,51.28 OK3.5 | RN2.3 46.98,17.94 44.76,20.16 44.76,50.01 46.03,51.28 | 46.03,51.28
  Bottom 0.406: 59.05,16.99 IC1.1 57.3,16.99 56.51,17.78 50.48,17.78 50.32,17.94 RN2.3
N$30
  Top 0.406: RN2.2 49.84,15.4 51.11,14.13 51.11,12.54 52.06,11.59 55.87,11.59 57.46,13.18 62.86,13.18 64.13,11.91 64.13,4.92 64.76,4.29 IC1.9
  Bottom 0.254: OK4.5 46.03,61.75 43.97,59.69 43.97,18.42 46.98,15.4 RN2.2
OPT_1
  Bottom 0.813: R3.1 57.62,30.96 56.98,30.32 OK1.2
OPT_2
  Bottom 0.813: R5.1 57.62,41.43 56.98,40.8 OK2.2
OPT_3
  Bottom 0.813: R7.1 57.62,51.91 56.98,51.28 OK3.2
OPT_4
  Bottom 0.813: R9.1 57.62,62.39 56.98,61.75 OK4.2
OPT_5
  Bottom 0.813: R11.1 29.36,60.64 30,61.28 OK5.2
OPT_6
  Bottom 0.813: R13.1 29.36,50.01 30.16,50.8 OK6.2
VCC
  Top 0.406: IC2.14 | IC2.14 22.85,16.99 21.11,18.42 R1.1 | R1.1 | R1.1
  Top 0.61: 26.5,16.99 | IC2.14 26.5,16.99 | 26.5,16.99 28.25,16.99 30.31,14.92 C18.1 31.58,12.86 32.85,12.86 RN1.1
  Top 0.813: C19.1 IC1.14
  Top 1.016: RN1.1 RN2.1 | C19.1 69.37,16.99 69.21,17.15 69.21,18.1 68.41,18.89 56.98,18.89 54.83,16.73 C1.+
  Bottom 1.016: 50,12.86 JP1.5 | 50,12.86 RN2.1 52.86,12.86 54.83,14.83 C1.+ | 50,12.86 50.06,12.79

### Text on the board
Top: TOP
Bottom: Torsteuerung Rev. 1.0 | BOT
tPlace: bus + | bus | bus -
tNames: www.freebus.org | Torsteuerung Rev. 1.0
Document: E5 | E4 | E6 | E3 | E7 | E2 | E8 | E1 | EIB + | EIB -
200bmp: D:/Freebus/Projekte/Grafik/freebusblackclean.bmp